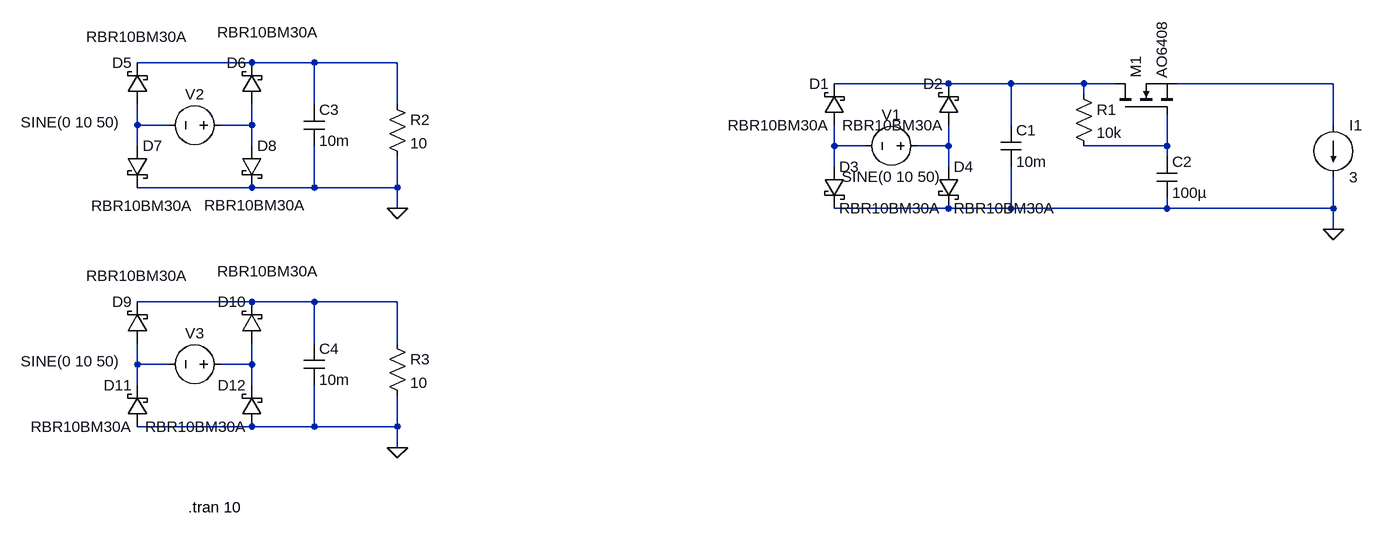
[diagram p0: schematic bridge_ng.asc]
bridge_ng.asc, the LTspice schematic file:
Version 4
SHEET 1 1060 732
WIRE -656 32 -832 32
WIRE -560 32 -656 32
WIRE -432 32 -560 32
WIRE 416 64 240 64
WIRE 512 64 416 64
WIRE 624 64 512 64
WIRE 672 64 624 64
WIRE 1008 64 768 64
WIRE 624 80 624 64
WIRE -560 96 -560 32
WIRE -432 96 -432 32
WIRE -832 128 -832 96
WIRE -784 128 -832 128
WIRE -656 128 -656 96
WIRE -656 128 -704 128
WIRE 512 128 512 64
WIRE 1008 128 1008 64
WIRE -832 160 -832 128
WIRE -656 160 -656 128
WIRE 240 160 240 128
WIRE 288 160 240 160
WIRE 416 160 416 128
WIRE 416 160 368 160
WIRE 752 160 752 112
WIRE 752 160 624 160
WIRE 752 176 752 160
WIRE 240 192 240 160
WIRE 416 192 416 160
WIRE -656 224 -832 224
WIRE -560 224 -560 160
WIRE -560 224 -656 224
WIRE -432 224 -432 176
WIRE -432 224 -560 224
WIRE -432 256 -432 224
WIRE 416 256 240 256
WIRE 512 256 512 192
WIRE 512 256 416 256
WIRE 752 256 752 240
WIRE 752 256 512 256
WIRE 1008 256 1008 208
WIRE 1008 256 752 256
WIRE 1008 288 1008 256
WIRE -656 400 -832 400
WIRE -560 400 -656 400
WIRE -432 400 -560 400
WIRE -560 464 -560 400
WIRE -432 464 -432 400
WIRE -832 496 -832 464
WIRE -784 496 -832 496
WIRE -656 496 -656 464
WIRE -656 496 -704 496
WIRE -832 528 -832 496
WIRE -656 528 -656 496
WIRE -656 592 -832 592
WIRE -560 592 -560 528
WIRE -560 592 -656 592
WIRE -432 592 -432 544
WIRE -432 592 -560 592
WIRE -432 624 -432 592
FLAG 1008 288 0
FLAG -432 256 0
FLAG -432 624 0
SYMBOL voltage 384 160 R90
WINDOW 0 -32 56 VBottom 2
WINDOW 3 32 56 VTop 2
WINDOW 123 0 0 Left 0
WINDOW 39 0 0 Left 0
SYMATTR InstName V1
SYMATTR Value SINE(0 10 50)
SYMBOL schottky 256 128 R180
WINDOW 0 24 64 Left 2
WINDOW 3 24 0 Left 2
SYMATTR InstName D1
SYMATTR Value RBR10BM30A
SYMATTR Description Diode
SYMATTR Type diode
SYMBOL schottky 432 128 R180
WINDOW 0 24 64 Left 2
WINDOW 3 24 0 Left 2
SYMATTR InstName D2
SYMATTR Value RBR10BM30A
SYMATTR Description Diode
SYMATTR Type diode
SYMBOL schottky 224 192 R0
SYMATTR InstName D3
SYMATTR Value RBR10BM30A
SYMATTR Description Diode
SYMATTR Type diode
SYMBOL schottky 400 192 R0
SYMATTR InstName D4
SYMATTR Value RBR10BM30A
SYMATTR Description Diode
SYMATTR Type diode
SYMBOL cap 496 128 R0
SYMATTR InstName C1
SYMATTR Value 10m
SYMBOL current 1008 128 R0
WINDOW 123 0 0 Left 0
WINDOW 39 0 0 Left 0
SYMATTR InstName I1
SYMATTR Value 3
SYMBOL res 608 64 R0
SYMATTR InstName R1
SYMATTR Value 10k
SYMBOL cap 736 176 R0
SYMATTR InstName C2
SYMATTR Value 100µ
SYMBOL nmos 672 112 R270
SYMATTR InstName M1
SYMATTR Value AO6408
SYMBOL voltage -688 128 R90
WINDOW 0 -32 56 VBottom 2
WINDOW 3 -20 247 VTop 2
WINDOW 123 0 0 Left 0
WINDOW 39 0 0 Left 0
SYMATTR InstName V2
SYMATTR Value SINE(0 10 50)
SYMBOL schottky -816 96 R180
WINDOW 0 24 64 Left 2
WINDOW 3 -61 104 Left 2
SYMATTR InstName D5
SYMATTR Value RBR10BM30A
SYMATTR Description Diode
SYMATTR Type diode
SYMBOL schottky -640 96 R180
WINDOW 0 24 64 Left 2
WINDOW 3 -87 111 Left 2
SYMATTR InstName D6
SYMATTR Value RBR10BM30A
SYMATTR Description Diode
SYMATTR Type diode
SYMBOL schottky -848 160 R0
WINDOW 3 -55 92 Left 2
SYMATTR InstName D7
SYMATTR Value RBR10BM30A
SYMATTR Description Diode
SYMATTR Type diode
SYMBOL schottky -672 160 R0
WINDOW 3 -57 91 Left 2
SYMATTR InstName D8
SYMATTR Value RBR10BM30A
SYMATTR Description Diode
SYMATTR Type diode
SYMBOL cap -576 96 R0
SYMATTR InstName C3
SYMATTR Value 10m
SYMBOL voltage -688 496 R90
WINDOW 0 -32 56 VBottom 2
WINDOW 3 -20 247 VTop 2
WINDOW 123 0 0 Left 0
WINDOW 39 0 0 Left 0
SYMATTR InstName V3
SYMATTR Value SINE(0 10 50)
SYMBOL schottky -816 464 R180
WINDOW 0 24 64 Left 2
WINDOW 3 -61 104 Left 2
SYMATTR InstName D9
SYMATTR Value RBR10BM30A
SYMATTR Description Diode
SYMATTR Type diode
SYMBOL schottky -640 464 R180
WINDOW 0 24 64 Left 2
WINDOW 3 -87 111 Left 2
SYMATTR InstName D10
SYMATTR Value RBR10BM30A
SYMATTR Description Diode
SYMATTR Type diode
SYMBOL schottky -816 592 R180
WINDOW 0 24 64 Left 2
WINDOW 3 24 0 Left 2
SYMATTR InstName D11
SYMATTR Value RBR10BM30A
SYMATTR Description Diode
SYMATTR Type diode
SYMBOL schottky -640 592 R180
WINDOW 0 24 64 Left 2
WINDOW 3 24 0 Left 2
SYMATTR InstName D12
SYMATTR Value RBR10BM30A
SYMATTR Description Diode
SYMATTR Type diode
SYMBOL cap -576 464 R0
SYMATTR InstName C4
SYMATTR Value 10m
SYMBOL res -448 80 R0
SYMATTR InstName R2
SYMATTR Value 10
SYMBOL res -448 448 R0
SYMATTR InstName R3
SYMATTR Value 10
TEXT -754 716 Left 2 !.tran 10

The netlist it stands for:
* bridge_ng.asc
V1 N007 N006 SINE(0 10 50)
D1 N006 N002 RBR10BM30A
D2 N007 N002 RBR10BM30A
D3 N006 0 RBR10BM30A
D4 N007 0 RBR10BM30A
C1 N002 0 10m
I1 N003 0 3
R1 N002 N008 10k
C2 N008 0 100µ
M1 N002 N008 N003 N003 AO6408
V2 N005 N004 SINE(0 10 50)
D5 N004 N001 RBR10BM30A
D6 N005 N001 RBR10BM30A
D7 N004 0 RBR10BM30A
D8 N005 0 RBR10BM30A
C3 N001 0 10m
V3 N011 N010 SINE(0 10 50)
D9 N010 N009 RBR10BM30A
D10 N011 N009 RBR10BM30A
D11 0 N010 RBR10BM30A
D12 0 N011 RBR10BM30A
C4 N009 0 10m
R2 N001 0 10
R3 N009 0 10
.model D D
.lib standard.dio
.model NMOS NMOS
.model PMOS PMOS
.lib standard.mos
.tran 10
.backanno
.end